# Altium schematic sheet STLINK_V2-1.SCHDOC: STLink V2-1
size A4; Author: Ph.A; SheetNumber: 7; SheetTotal: 8
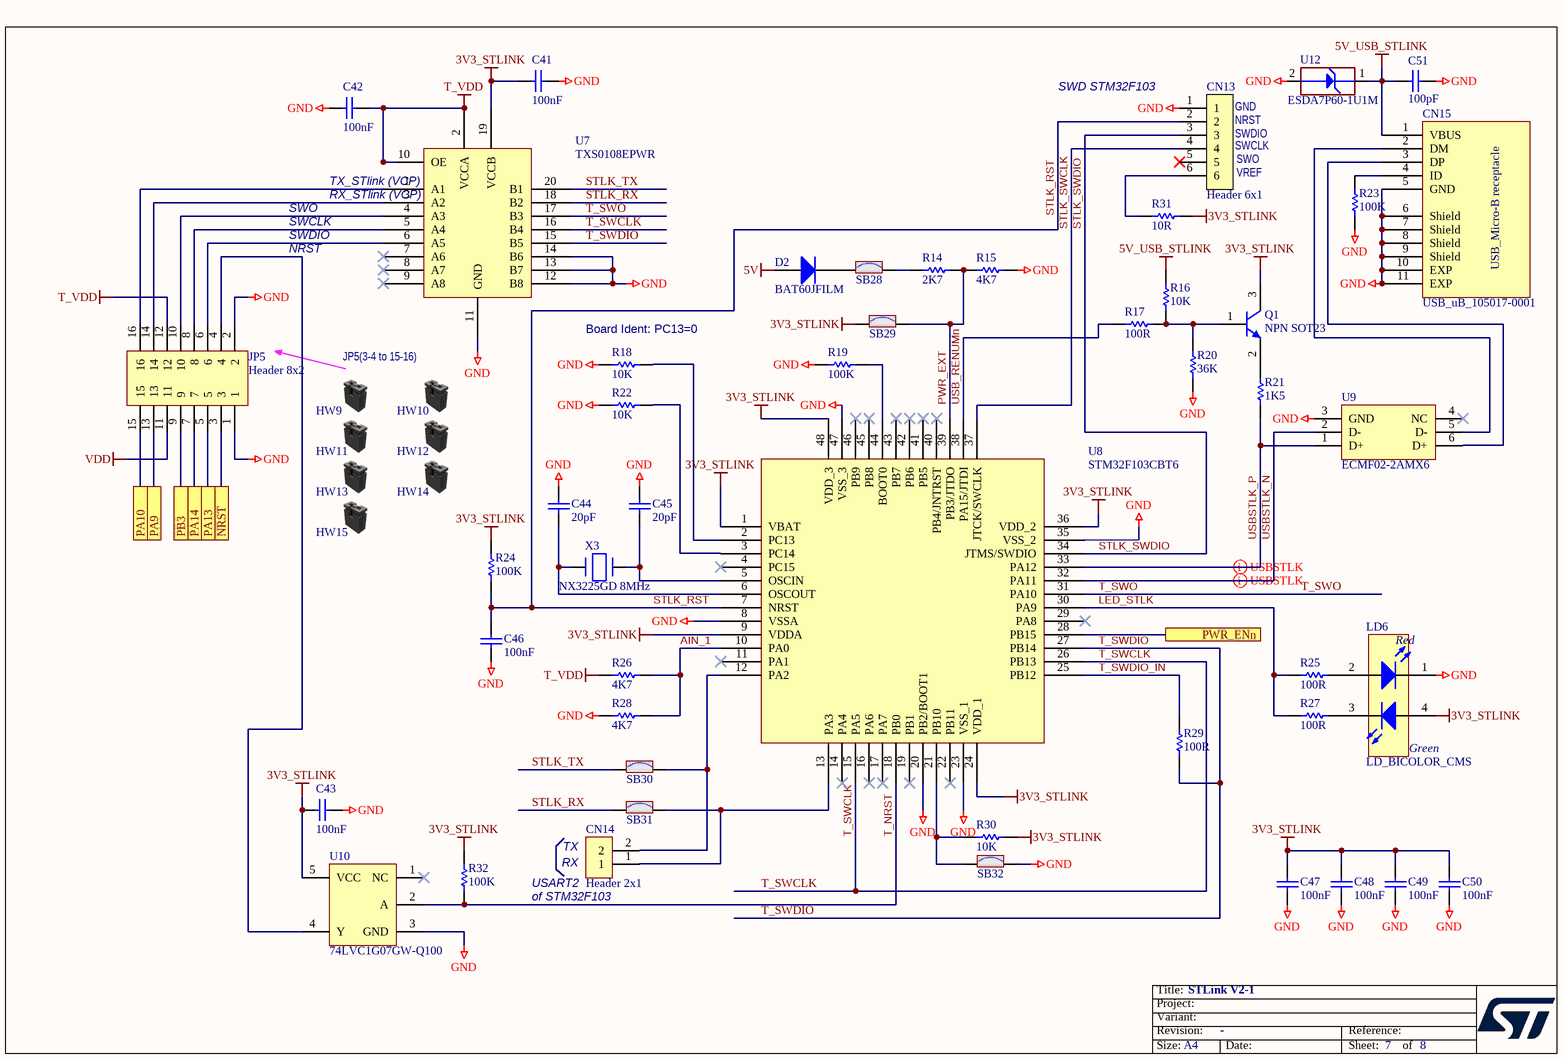
[diagram p0: STLINK_V2-1.SCHDOC]

## Parts
C41  value 100nF  [C0402]  (hidden comment: Capacitor)
C42  value 100nF  [C0402]  (hidden comment: Capacitor)
C43  value 100nF  [C0402]  (hidden comment: Capacitor)
C44  value 20pF  [C0402]  (hidden comment: Capacitor)
C45  value 20pF  [C0402]  (hidden comment: Capacitor)
C46  value 100nF  [C0402]  (hidden comment: Capacitor)
C47  value 100nF  [C0402]  (hidden comment: Capacitor)
C48  value 100nF  [C0402]  (hidden comment: Capacitor)
C49  value 100nF  [C0402]  (hidden comment: Capacitor)
C50  value 100nF  [C0402]  (hidden comment: Capacitor)
C51  value 100pF  [C0402]  (hidden comment: Capacitor)
CN13  Header 6x1  [CON_SAMTEC_TSW-106-07-X-S]
CN14  Header 2x1  [CON_SAMTEC_TSW-102-07-G-S]
CN15  value USB_uB_105017-0001  [CON_USBMICROB_MOLEX_105017-0001_H2P90]  (hidden comment: USB_uB_105017.0001)
D2  BAT60JFILM  [DIO_SOD323]
HW9  Shunt Black 2.54mm  (value not drawn)  (mechanical)
HW10  Shunt Black 2.54mm  (value not drawn)  (mechanical)
HW11  Shunt Black 2.54mm  (value not drawn)  (mechanical)
HW12  Shunt Black 2.54mm  (value not drawn)  (mechanical)
HW13  Shunt Black 2.54mm  (value not drawn)  (mechanical)
HW14  Shunt Black 2.54mm  (value not drawn)  (mechanical)
HW15  Shunt Black 2.54mm  (value not drawn)  (mechanical)
JP5  Header 8x2  [CON_SAMTEC_TSW-108-07-X-D]
LD6  LD_BICOLOR_CMS  [LED_BI-GR_HSMF-A201-A00J1]
Q1  value NPN SOT23  [NPN_SOT23]  (hidden comment: 9013-SOT23)
R14  value 2K7  [R0402]  (hidden comment: Resistor)
R15  value 4K7  [R0402]  (hidden comment: Resistor)
R16  value 10K  [R0402]  (hidden comment: Resistor)
R17  value 100R  [R0402]  (hidden comment: Resistor)
R18  value 10K  [R0402]  (hidden comment: Resistor)
R19  value 100K  [R0402]  (hidden comment: Resistor)
R20  value 36K  [R0402]  (hidden comment: Resistor)
R21  value 1K5  [R0402]  (hidden comment: Resistor)
R22  value 10K  [R0402]  (hidden comment: Resistor)
R23  value 100K  [R0402]  (hidden comment: Resistor)
R24  value 100K  [R0402]  (hidden comment: Resistor)
R25  value 100R  [R0402]  (hidden comment: Resistor)
R26  value 4K7  [R0402]  (hidden comment: Resistor)
R27  value 100R  [R0402]  (hidden comment: Resistor)
R28  value 4K7  [R0402]  (hidden comment: Resistor)
R29  value 100R  [R0402]  (hidden comment: Resistor)
R30  value 10K  [R0402]  (hidden comment: Resistor)
R31  value 10R  [R0402]  (hidden comment: Resistor)
R32  value 100K  [R0402]  (hidden comment: Resistor)
SB28  SB_ON  [SOLDER-BRIDGE_R0402-0R]  (value not drawn)
SB29  SB_ON  [SOLDER-BRIDGE_R0402-0R]  (value not drawn)
SB30  SB_ON  [SOLDER-BRIDGE_R0402-0R]  (value not drawn)
SB31  SB_ON  [SOLDER-BRIDGE_R0402-0R]  (value not drawn)
SB32  SB_ON  [SOLDER-BRIDGE_R0402-0R]  (value not drawn)
U7  TXS0108EPWR  [ICC_TSSOP20_6P50X4P40_P065]
U8  STM32F103CBT6  [ICC_LQFP48_7X7_P050]
U9  ECMF02-2AMX6  [ESD_QFN-6L_1P7X1P5_P050]
U10  74LVC1G07GW-Q100  [ICC_TSSOP5_SOT353-1_2P05X1P25_P065]
U12  value ESDA7P60-1U1M  [ESD_QFN2_1P6X1_P125]  (hidden comment: ESD-TRANSIL)
X3  value NX3225GD 8MHz  [CRY_NX3225GD_2P]  (hidden comment: XTAL_2_PINS)

## Ports
NRST, PA9, PA10, PA13, PA14, PB3, PWR_ENn

## Nets
3V3_STLINK: C41.1 C43.1 C47.2 C48.2 C49.2 C50.2 LD6.4(YellowGreen_anode) Q1.3(C) R24.2 R30.1 R31.2 R32.2 SB29.1 U7.19(VCCB) U8.1(VBAT) U8.9(VDDA) U8.24(VDD_1) U8.36(VDD_2) U8.48(VDD_3) U10.5(VCC)
5V: D2.1(A)
5V_USB_STLINK: C51.1 CN15.1(VBUS) R16.2 U12.1(IO1)
GND: C41.2 C42.1 C43.2 C44.2 C45.2 C46.1 C47.1 C48.1 C49.1 C50.1 C51.2 CN13.1 CN15.5(GND) CN15.6(Shield) CN15.7(Shield) CN15.8(Shield) CN15.9(Shield) CN15.10(EXP) CN15.11(EXP) JP5.1 JP5.2 LD6.1(RED_cathode) R15.2 R18.2 R19.2 R20.1 R22.2 R23.1 R28.1 SB32.2 U7.11(GND) U7.12(B8) U7.13(B7) U7.14(B6) U8.8(VSSA) U8.20(PB2/BOOT1) U8.23(VSS_1) U8.35(VSS_2) U8.47(VSS_3) U9.3(GND) U10.3(GND) U12.2(GND)
T_VDD: C42.2 JP5.12 R26.1 U7.2(VCCA) U7.10(OE)
VDD: JP5.11
AIN_1: R26.2 R28.2 U8.10(PA0)
LED_STLK: R25.1 R27.1 U8.30(PA9)
NRST: JP5.3 ; port NRST
PA9: JP5.13 ; port PA9
PA10: JP5.15 ; port PA10
PA13: JP5.5 ; port PA13
PA14: JP5.7 ; port PA14
PB3: JP5.9 ; port PB3
PWR_ENn: U8.28(PB15) ; port PWR_ENn
PWR_EXT: R14.2 R15.1 SB29.2 U8.39(PB3/JTDO)
STLK_RST: C46.2 CN13.2 R24.1 U8.7(NRST)
STLK_RX: SB31.1 U7.18(B2)
STLK_SWCLK: CN13.4 U8.37(JTCK/SWCLK)
STLK_SWDIO: CN13.3 U8.34(JTMS/SWDIO)
STLK_TX: SB30.1 U7.20(B1)
T_NRST: R32.1 U8.18(PB0) U10.2(A)
T_SWCLK: U7.16(B4) U8.15(PA5) U8.26(PB13)
T_SWDIO: R29.1 U7.15(B5) U8.27(PB14)
T_SWDIO_IN: R29.2 U8.25(PB12)
T_SWO: U7.17(B3) U8.31(PA10)
USB_RENUMn: R17.1 U8.38(PA15/JTDI)
USBSTLK_N: U8.32(PA11) U9.2(D-)
USBSTLK_P: R21.1 U8.33(PA12) U9.1(D+)
NetC44_1: C44.1 U8.6(OSCOUT) X3.1(X1)
NetC45_1: C45.1 U8.5(OSCIN) X3.2(X2)
NetCN13_6: CN13.6 R31.1
NetCN14_1: CN14.1 SB31.2 U8.13(PA3)
NetCN14_2: CN14.2 SB30.2 U8.12(PA2)
NetCN15_2: CN15.2(DM) U9.5(D-)
NetCN15_3: CN15.3(DP) U9.6(D+)
NetCN15_4: CN15.4(ID) R23.2
NetD2_2: D2.2(K) SB28.1
NetJP5_4: JP5.4 U10.4(Y)
NetJP5_6: JP5.6 U7.6(A5)
NetJP5_8: JP5.8 U7.5(A4)
NetJP5_10: JP5.10 U7.4(A3)
NetJP5_14: JP5.14 U7.3(A2)
NetJP5_16: JP5.16 U7.1(A1)
NetLD6_2: LD6.2(Red_anode) R25.2
NetLD6_3: LD6.3(YellowGreen_cathode) R27.2
NetQ1_1: Q1.1(B) R16.1 R17.2 R20.2
NetQ1_2: Q1.2(E) R21.2
NetR14_1: R14.1 SB28.2
NetR18_1: R18.1 U8.2(PC13)
NetR19_1: R19.1 U8.44(BOOT0)
NetR22_1: R22.1 U8.3(PC14)
NetR30_2: R30.2 SB32.1 U8.21(PB10)

Not connected (* = marked no-connect by the designer): CN13 5*; U7 7(A6)* 8(A7)* 9(A8)*; U8 4(PC15)* 11(PA1)* 14(PA4)* 16(PA6)* 17(PA7)* 19(PB1)* 22(PB11)* 29(PA8)* 40(PB4/JNTRST)* 41(PB5)* 42(PB6)* 43(PB7)* 45(PB8)* 46(PB9)*; U9 4(NC)*; U10 1(NC)*

## Layout directives
differential pair; net class DIFF90: USBSTLK_N, USBSTLK_P

## Notes on the sheet
- SWD STM32F103
- (near CN13) SWDIO
- (near CN13) NRST
- (near CN13) GND
- TX_STlink (VCP)
- RX_STlink (VCP)
- (near CN13) SWCLK
- (near CN13) SWO
- (near CN13) VREF
- SWO
- SWCLK
- SWDIO
- NRST
- (near R18) Board Ident: PC13=0
- JP5(3-4 to 15-16)
- (near CN14) RX
- TX
- USART2
- (near CN14) of STM32F103
- Title:
- Project:
- Size:
- Revision:
- Variant:
- A4
- -
- Date:
- Reference:
- Sheet:
- of
- (in symbol MCD-00028) USB_Micro-B receptacle
- (in symbol MCD-00051) Red; Green

## Library data of the parts
C41-C43 C46-C50 = MCD-00006: Capacitor, MLCC, 100nF, 16V, X7R, +/-10%, 0402, T=0.5mm; Manufacturer_Part_Number: CC0402KRX7R7BB104; Manufacturer: YAGEO; Alternate_Manufacturer_Part_Number: GCM155R71C104KA55D; Alternate_Manufacturer: MURATA; Part_Preference: Recommended; Order_Code_RS: 616-9701; Internal_Part_Number: MCD-00006; Status: Released; Part_Type: Capacitor; Package: C0402; ComponentLink1URL: http://tunmcdsvn.tun.st.com/Component_Datasheet_Library/Trunk/Capacitors/Yageo_Multilayer_Capacitor_X7R_series_100pF_to_22uF; Order_Code_Digikey: 311-1338-1-ND; Order_Code_Farnell: 9402047
C44 C45 = MCD-00016: Capacitor, MLCC, 20pF, 50V, NPO, +/- 5%, 0402, T=0,5mm; Manufacturer_Part_Number: CC0402JRNPO9BN200; Manufacturer: YAGEO; Part_Preference: Recommended; Internal_Part_Number: MCD-00016; Status: Released; Part_Type: Capacitor; Package: C0402; ComponentLink1URL: http://tunmcdsvn.tun.st.com/Component_Datasheet_Library/Trunk/Capacitors/Yageo_Capacitor_NP0_16V-to-50V; Order_Code_Digikey: 311-1417-1-ND; Order_Code_Farnell: N/A; Order_Code_RS: N/A
C51 = MCD-00205: Capacitor,MLCC,100pF,50V,NPO,+/-5%,0402,T=0,5mm; Manufacturer_Part_Number: CC0402JRNPO9BN101; Manufacturer: YAGEO; Part_Preference: Recommended; Internal_Part_Number: MCD-00205; Status: Released; Part_Type: Capacitor; Package: C0402; ComponentLink1URL: http://tunmcdsvn.tun.st.com/Component_Datasheet_Library/Trunk/Capacitors/Yageo_Capacitor_NP0_16V-to-50V; Order_Code_Digikey: 311-1024-1-ND; Order_Code_Farnell: 3019226RL; Order_Code_RS: N/A
CN13 = MCD-00212: Header, 6x1, 2,54mm, VR, TH, Height 5.84mm/2.54mm; Part_Type: Connector; Manufacturer_Part_Number: TSW-106-07-G-S; Manufacturer: SAMTEC; Part_Preference: Recommended; Internal_Part_Number: MCD-00212; Value: Header 6x1; Status: Released; ComponentLink1URL: http://tunmcdsvn.tun.st.com/Component_Datasheet_Library/Trunk/Connectors/Samtec_TSW-HTSW-series
CN14 = MCD-00032: Header, 2x1, 2,54mm, VR, TH, Height 5.84mm/2.54mm; Manufacturer_Part_Number: TSW-102-07-G-S; Manufacturer: SAMTEC; Part_Type: Connector; Part_Preference: Recommended; Alternate_Manufacturer: JIUBABA; Alternate_Manufacturer_Part_Number: 313102S111116; Internal_Part_Number: MCD-00032; Value: Header 2x1; Status: Released; ComponentLink1URL: http://tunmcdsvn.tun.st.com/Component_Datasheet_Library/Trunk/Connectors/Samtec_TSW-HTSW-series
CN15 = MCD-00028: USB-MICRO-B, 0.65mm, RA, SMT, Bottom Mount,; Part_Type: Connector; Manufacturer_Part_Number: 1050170001; Manufacturer: MOLEX; Part_Preference: Recommended; Internal_Part_Number: MCD-00028; Status: Released; ComponentLink1URL: http://tunmcdsvn.tun.st.com/Component_Datasheet_Library/Trunk/Connectors/Molex_Connector-USB-microB_105017-0001
D2 = MCD-00034: Manufacturer: STMICROELECTRONICS; Part_Type: Diode; BMS_Part_Number: 9151097; Part_Preference: Recommended; Manufacturer_HQ_COO: EU; Internal_Part_Number: MCD-00034; Value: BAT60JFILM; Manufacturer_Part_Number: BAT60JFILM; Status: Released; ComponentLink1URL: http://tunmcdsvn.tun.st.com/Component_Datasheet_Library/Trunk/Diodes/STM_Diode_BAT60JFILM-SOD323
HW9-HW15 = MCD-00043: SHUNT 2.54mm BLACK; Manufacturer_Part_Number: SNT-100-BK-G; Manufacturer: SAMTEC; Part_Type: Misc; Part_Preference: Recommended; Alternate_Manufacturer: JIUBABA; Alternate_Manufacturer_Part_Number: 316102S111A; Value: SNT-100-BK-G; Internal_Part_Number: MCD-00043; Status: Released; ComponentLink1URL: http://tunmcdsvn.tun.st.com/Component_Datasheet_Library/Trunk/Connectors/Samtec_Shunt_Jumper_SNT100
JP5 = MCD-02061: Header, 8x2, 2,54mm, VR, TH, Height 5.84mm/2.54mm; Part_Type: Connector; Manufacturer_Part_Number: TSW-108-07-G-D; Manufacturer: SAMTEC; Part_Preference: Recommended; Order_Code_RS: 161-2292; Internal_Part_Number: MCD-02061; Value: Header 8x2; Status: Checked; ComponentLink1URL: http://tunmcdsvn.tun.st.com/Component_Datasheet_Library/Trunk/Connectors/Samtec_TSW-HTSW-series; Alternate_Manufacturer: N/A; Alternate_Manufacturer_Part_Number: N/A; Package: N/A; Order_Code_Digikey: SAM1028-08-ND; Order_Code_Farnell: 2578721
LD6 = MCD-00051: LED Bicolor; Part_Type: Display; Manufacturer_Part_Number: HSMF-A201-A00J1; Manufacturer: AVAGO TECHNOLOGIES; Alternate_Manufacturer_Part_Number: LE-RGW35280; Alternate_Manufacturer: EVERLUCK; Part_Preference: Forbidden; Internal_Part_Number: MCD-00051; Value: LD_BICOLOR_CMS; Status: Released; ComponentLink1URL: http://tunmcdsvn.tun.st.com/Component_Datasheet_Library/Trunk/Display/Avago_LED-SMC_HSMx-A2xx-02Feb2012
Q1 = MCD-00073: NPN Bipolar Transistor; Manufacturer_Part_Number: BSR14; Manufacturer: ON SEMICONDUCTOR; Part_Type: IC; Part_Preference: Recommended; Alternate_Manufacturer_Part_Number: MMBT2222LT1G / MMBT2222ALT1G / MMBT2222ALT3G; Revision: *; Internal_Part_Number: MCD-00073; Status: Released; Alternate_Manufacturer: ON SEMICONDUCTOR; Package: SOT23; ComponentLink1URL: http://tunmcdsvn.tun.st.com/Component_Datasheet_Library/Trunk/IC/NXP_Transistor_BSR14
R14 = MCD-00055: Resistor,2K7,0402,1%,1/16W; Manufacturer_Part_Number: RC0402FR-072K7L; Manufacturer: YAGEO; Part_Preference: Recommended; Internal_Part_Number: MCD-00055; Status: Released; Part_Type: Resistor; Package: R0402; ComponentLink1URL: http://tunmcdsvn.tun.st.com/Component_Datasheet_Library/Trunk/Resistors/Yageo_Resistor_RC0402-series; Order_Code_Digikey: 311-2.70KLRCT-ND; Order_Code_Farnell: 9239286; Order_Code_RS: N/A
R15 R26 R28 = MCD-00065: Resistor,4K7,0402,1%,1/16W; Manufacturer_Part_Number: RC0402FR-074K7L; Manufacturer: YAGEO; Alternate_Manufacturer_Part_Number: RT0402FRE074K7L; Part_Preference: Recommended; Internal_Part_Number: MCD-00065; Status: Released; Part_Type: Resistor; Alternate_Manufacturer: YAGEO; Package: R0402; ComponentLink1URL: http://tunmcdsvn.tun.st.com/Component_Datasheet_Library/Trunk/Resistors/Yageo_Resistor_RC0402-series; Order_Code_Digikey: 311-4.7KLRCT-ND; Order_Code_Farnell: 9239316; Order_Code_RS: N/A
R16 R18 R22 R30 = MCD-00053: Resistor,10K,0402,1%,1/16W; Manufacturer_Part_Number: RC0402FR-0710KL; Manufacturer: YAGEO; BMS_Part_Number: 9131590; Part_Preference: Recommended; Internal_Part_Number: MCD-00053; Status: Released; Part_Type: Resistor; Package: R0402; ComponentLink1URL: http://tunmcdsvn.tun.st.com/Component_Datasheet_Library/Trunk/Resistors/Yageo_Resistor_RC0402-series; Order_Code_Digikey: 311-10.0KLRCT-ND; Order_Code_Farnell: 9239359; Order_Code_RS: N/A
R17 R25 R27 R29 = MCD-00067: Resistor,100R,0402,1%,1/16W; Manufacturer_Part_Number: RC0402FR-07100RL; Manufacturer: YAGEO; Part_Preference: Recommended; Internal_Part_Number: MCD-00067; Status: Released; Part_Type: Resistor; Package: R0402; ComponentLink1URL: http://tunmcdsvn.tun.st.com/Component_Datasheet_Library/Trunk/Resistors/Yageo_Resistor_RC0402-series; Order_Code_Digikey: 311-100LRCT-ND; Order_Code_Farnell: 9239111; Order_Code_RS: N/A
R19 R23 R24 R32 = MCD-00059: Resistor,100K,0402,1%,1/16W; Manufacturer_Part_Number: RC0402FR-07100KL; Manufacturer: YAGEO; Alternate_Manufacturer_Part_Number: RT0402FRE07100KL; Part_Preference: Recommended; Internal_Part_Number: MCD-00059; Status: Released; Part_Type: Resistor; Alternate_Manufacturer: YAGEO; Package: R0402; ComponentLink1URL: http://tunmcdsvn.tun.st.com/Component_Datasheet_Library/Trunk/Resistors/Yageo_Resistor_RC0402-series; Order_Code_Digikey: 311-100KLRTR-ND; Order_Code_Farnell: 2421891; Order_Code_RS: N/A
R20 = MCD-00069: Resistor,36K,0402,1%,1/16W; Manufacturer_Part_Number: RC0402FR-0736KL; Manufacturer: YAGEO; Part_Preference: Recommended; Internal_Part_Number: MCD-00069; Status: Released; Part_Type: Resistor; Package: R0402; ComponentLink1URL: http://tunmcdsvn.tun.st.com/Component_Datasheet_Library/Trunk/Resistors/Yageo_Resistor_RC0402-series; Order_Code_Digikey: 311-36.0KLRCT-ND; Order_Code_Farnell: 1458788; Order_Code_RS: N/A
R21 = MCD-00068: Resistor,1K5,0402,1%,1/16W; Manufacturer_Part_Number: RC0402FR-071K5L; Manufacturer: YAGEO; Part_Preference: Recommended; Internal_Part_Number: MCD-00068; Status: Released; Part_Type: Resistor; Package: R0402; ComponentLink1URL: http://tunmcdsvn.tun.st.com/Component_Datasheet_Library/Trunk/Resistors/Yageo_Resistor_RC0402-series; Order_Code_Digikey: 311-1.50KLRCT-ND; Order_Code_Farnell: 9239251; Order_Code_RS: N/A
R31 = MCD-00358: Resistor,10R,0402,1%,1/16W; Manufacturer_Part_Number: RC0402FR-0710RL; Manufacturer: YAGEO; Part_Preference: Recommended; Order_Code_RS: 618-5848; Internal_Part_Number: MCD-00358; Status: Released; Part_Type: Resistor; Package: R0402; ComponentLink1URL: http://tunmcdsvn.tun.st.com/Component_Datasheet_Library/Trunk/Resistors/Yageo_Resistor_RC0402-series; Order_Code_Digikey: 311-10.0LRCT-ND; Order_Code_Farnell: 9238999
SB28-SB32 = MCD-01618: Solder Bridge 0402 ON; Part_Type: Misc; Manufacturer_Part_Number: RC0402JR-070RL; Manufacturer: YAGEO; Part_Preference: Recommended; Order_Code_RS: 618-5804; Internal_Part_Number: MCD-01618; Status: Released; Package: SB0402; ComponentLink1URL: http://tunmcdsvn.tun.st.com/Component_Datasheet_Library/Trunk/Resistors/Yageo_Resistor_RC0402-series; Order_Code_Digikey: 311-0.0JRTR-ND; Order_Code_Farnell: 2363467
U7 = MCD-00289: 8bits_bidirectionnal level shifter, Delay 312ns/1V8; Part_Type: IC; Manufacturer: TEXAS INSTRUMENTS; Part_Preference: Recommended; Internal_Part_Number: MCD-00289; Value: TXS0108EPWR; Status: Released; Manufacturer_Part_Number: TXS0108EPWR; ComponentLink1URL: http://tunmcdsvn.tun.st.com/Component_Datasheet_Library/Trunk/IC/TI_8bits_level_shifter_bidir_TXS0108E
U8 = MCD-00085: Medium-density performance line ARM-based 32-bit MCU with 128KB Flash; Part_Type: IC; Manufacturer: STMICROELECTRONICS; BMS_Part_Number: 9175111; Part_Preference: Recommended; Manufacturer_HQ_COO: EU; Internal_Part_Number: MCD-00085; Value: STM32F103CBT6; Status: Released; Manufacturer_Part_Number: STM32F103CBT6; ComponentLink1URL: http://tunmcdsvn.tun.st.com/Component_Datasheet_Library/Trunk/IC/STM_STM32F103CBT6
U9 = MCD-00649: Common mode filter with ESD protection for USB 2.0 interface; Part_Type: Diode; Manufacturer: STMICROELECTRONICS; BMS_Part_Number: 9151138; Part_Preference: Recommended; Manufacturer_HQ_COO: EU; Internal_Part_Number: MCD-00649; Value: ECMF02-2AMX6; Status: Released; Manufacturer_Part_Number: ECMF02-2AMX6; ComponentLink1URL: http://tunmcdsvn.tun.st.com/Component_Datasheet_Library/Trunk/Diodes/STM_ESD_ECMF02-2AMX6
U10 = MCD-01960: Buffer/Driver 1-CH Non-Inverting Open Drain CMOS Automotive 5-Pin TSSOP T/R; Part_Type: IC; Manufacturer: NEXPERIA; Part_Preference: Recommended; Value: Buffer/Driver 1-CH; Status: Released; ComponentLink1URL: http://tunmcdsvn.tun.st.com/Component_Datasheet_Library/Trunk/IC/NEXPERIA_74LVC1G07GW-Q100; Internal_Part_Number: MCD-01960; Manufacturer_Part_Number: 74LVC1G07GW-Q100; Package: TSSOP5
U12 = MCD-00251: High power transient voltage suppressor, 7V breakdown; Part_Type: Diode; Manufacturer: STMICROELECTRONICS; BMS_Part_Number: 9179042; Part_Preference: Recommended; Manufacturer_HQ_COO: EU; Internal_Part_Number: MCD-00251; Status: Released; Manufacturer_Part_Number: ESDA7P60-1U1M; ComponentLink1URL: http://tunmcdsvn.tun.st.com/Component_Datasheet_Library/Trunk/Diodes/STM_ESD_ESDA7P60-1U1M
X3 = MCD-00092: Crystal 8MHz, 8pF, +-20ppm, 500ohms max,  SMD; Part_Type: Crystal oscillator; Manufacturer_Part_Number: NX3225GD 8MHz EXS00A-CG04874; Manufacturer: NDK; BMS_Part_Number: 9157029; Part_Preference: Recommended; Internal_Part_Number: MCD-00092; Status: Released; ComponentLink1URL: http://tunmcdsvn.tun.st.com/Component_Datasheet_Library/Trunk/Crystal_Osc/NDK_Crystal-For-ST_NX3225GD 8MHz EXS00A-CG04874 (EXS10B-20725); Order_Code_Digikey: 644-1391